# EAGLE design ds1307 (EAGLE 8.3.0)
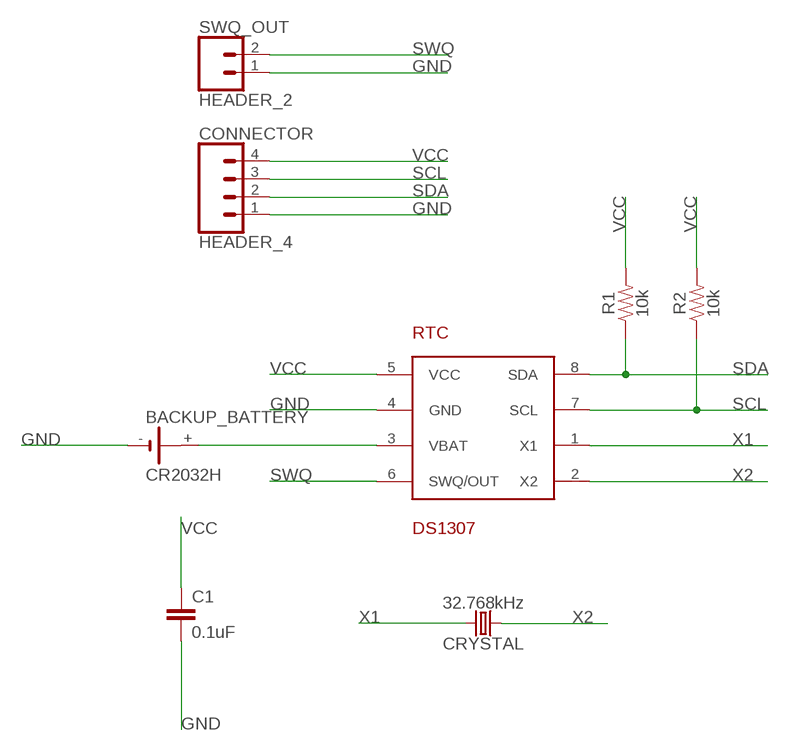
[diagram p0: schematic, sheet 1]

## Parts
BACKUP_BATTERY  CR2032H  [CR2032H]
C1  0.1uF  0.1UF-KIT-EZ-50V-20%  [CAP-PTH-SMALL-KIT]
CONNECTOR  HEADER_4  CONN_04POLAR  [MOLEX-1X4]
CRYSTAL  32.768kHz  CRYSTAL-32.768KHZPTH-2X6  [CRYSTAL-PTH-2X6-CYL]
R1  10k  10KOHM-HORIZ-1/4W-1%  [AXIAL-0.3]
R2  10k  10KOHM-HORIZ-1/4W-1%  [AXIAL-0.3]
RTC  DS1307  [MAXIM_DIP8]
SWQ_OUT  HEADER_2  CONN_02  [1X02]

## Nets
GND: BACKUP_BATTERY.- C1.2 CONNECTOR.1 RTC.4(GND) SWQ_OUT.1
N$1: BACKUP_BATTERY.+ RTC.3(VBAT)
SCL: CONNECTOR.3 R2.P$1 RTC.7(SCL)
SDA: CONNECTOR.2 R1.P$1 RTC.8(SDA)
SWQ: RTC.6(SWQ/OUT) SWQ_OUT.2
VCC: C1.1 CONNECTOR.4 R1.P$2 R2.P$2 RTC.5(VCC)
X1: CRYSTAL.2 RTC.1(X1)
X2: CRYSTAL.1 RTC.2(X2)
Unconnected: BACKUP_BATTERY.+@1(+)

## Library data of the parts
BACKUP_BATTERY = battery:CR2032H: LI BATTERY Varta
C1 = SparkFun-Capacitors:0.1UF: 0.1µF ceramic capacitors A capacitor is a passive two-terminal electrical component used to store electrical energy temporarily in an electric field.; PROD_ID: CAP-08370
CONNECTOR = SparkFun-Connectors:CONN_04: Multi connection point. Often used as Generic Header-pin footprint for 0.1 inch spaced/style header connections On any of the 0.1 inch spaced packages, you can populate with these: Break Away Headers - Straight <https://www.sparkfun.com/products/116> (PRT-00116) Break Away Male Headers - Right Angle <https://www.sparkfun.com/products/553> (PRT-00553) Female Headers <https://www.sparkfun.com/products/115> (PRT-00115) Break Away Headers - Machine Pin <https://www.sparkfun.com/products/117> (PRT-00117) Break Away Female Headers - Swiss Machine Pin <https://www.sparkfun.com/products/743> (PRT-00743) For SCREWTERMINALS and SPRING TERMINALS visit here: Screw Terimnals on SparkFun.com <https://www.sparkfun.com/search/results?term=Screw+Terminals> (5mm/3.5mm/2.54mm spacing) This device is also useful as a general connection point to wire up your design to another part of your project. Our various solder wires solder well into these plated through hole pads. Hook-Up Wire - Assortment (Stranded, 22 AWG) <https://www.sparkfun.com/products/11375> (PRT-11375) Hook-Up Wire - Assortment (Solid Core, 22 AWG) <https://www.sparkfun.com/products/11367> (PRT-11367) View the entire wire category on our website here <https://www.sparkfun.com/categories/141> Special notes: Molex polarized connector foot print use with SKU : PRT-08231 with associated crimp pins and housings. 1MM SMD Version SKU: PRT-10208; PROD_ID: CONN-08186; SF_ID: PRT-08231
CRYSTAL = SparkFun-Clocks:CRYSTAL-32.768KHZ: 32.768kHz Crystal Frequency: 32.768kHz Frequency Stability: ±20ppm Load Capacitance: 12.5pF (PTH-2X6 & SMD-3.2X1.5), 6pF (SMD-2X6) SparkFun Products: SparkFun BigTime Watch Kit <https://www.sparkfun.com/products/11734> SparkFun nRF52832 Breakout <https://www.sparkfun.com/products/13990> SparkFun Real Time Clock Module <https://www.sparkfun.com/products/12708>; PROD_ID: XTAL-10112
R1 R2 = SparkFun-Resistors:10KOHM: 10kΩ resistor A resistor is a passive two-terminal electrical component that implements electrical resistance as a circuit element. Resistors act to reduce current flow, and, at the same time, act to lower voltage levels within circuits. - Wikipedia; PROD_ID: RES-12183
RTC = parts:DS1307
SWQ_OUT = SparkFun-Connectors:CONN_02: Multi connection point. Often used as Generic Header-pin footprint for 0.1 inch spaced/style header connections On any of the 0.1 inch spaced packages, you can populate with these: Break Away Headers - Straight <https://www.sparkfun.com/products/116> (PRT-00116) Break Away Male Headers - Right Angle <https://www.sparkfun.com/products/553> (PRT-00553) Female Headers <https://www.sparkfun.com/products/115> (PRT-00115) Break Away Headers - Machine Pin <https://www.sparkfun.com/products/117> (PRT-00117) Break Away Female Headers - Swiss Machine Pin <https://www.sparkfun.com/products/743> (PRT-00743) For SCREWTERMINALS and SPRING TERMINALS visit here: Screw Terimnals on SparkFun.com <https://www.sparkfun.com/search/results?term=Screw+Terminals> (5mm/3.5mm/2.54mm spacing) This device is also useful as a general connection point to wire up your design to another part of your project. Our various solder wires solder well into these plated through hole pads. Hook-Up Wire - Assortment (Stranded, 22 AWG) <https://www.sparkfun.com/products/11375> (PRT-11375) Hook-Up Wire - Assortment (Solid Core, 22 AWG) <https://www.sparkfun.com/products/11367> (PRT-11367) View the entire wire category on our website here <https://www.sparkfun.com/categories/141> Special notes: Molex polarized connector foot print use with: PRT-08233 with associated crimp pins and housings. 2.54_SCREWTERM for use with PRT-10571. 3.5mm Screw Terminal footprints for PRT-08084 5mm Screw Terminal footprints for use with PRT-08432

## Board
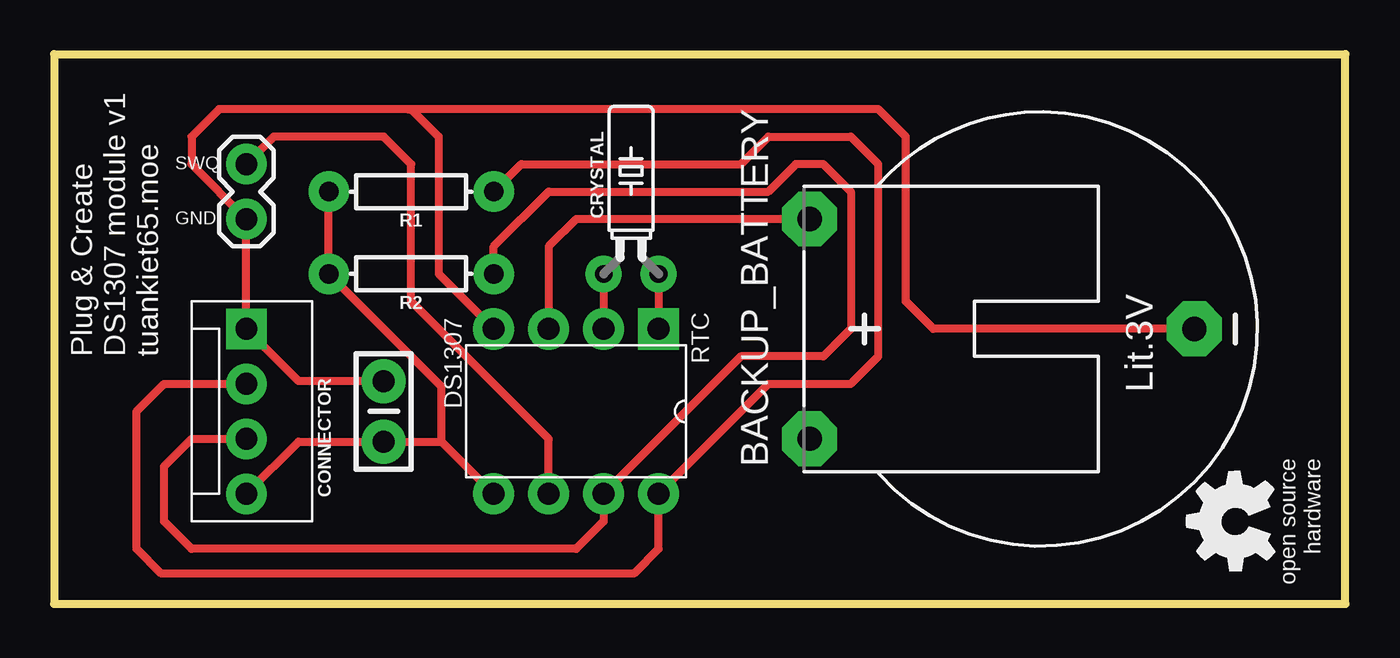
[diagram p1: board, top side]

Size 59.69 x 25.4 mm. Coordinates in mm from the lower left corner, seen from the top.
Outline: 59.69,24.13 59.69,0
Outline: 59.69,0 0,0 0,25.4 59.69,25.4 59.69,0
Copper layers (1*16): Top 0.0356mm / dielectric 1.5011mm / Bottom 0.0356mm
Design rules "oshpark-2layer": minimum track width 6mil, minimum drill 13mil, track to track 6mil, track to pad 6mil, pad to pad 6mil, via to via 6mil, smd to smd 6mil, copper to edge 15mil, drill to drill 6mil, minimum pad ring 7mil, minimum via ring 7mil, stop-mask expansion 2.5mil, vias tented up to drill 0mil, thermal gap 10mil

### Footprints (pad centres in the part's own frame; a part is rotated, then mirrored left to right if it is on the bottom)
CR2032H = drill 1.118 pad 2.54 octagon: + 5.08,10.795; +@1 -5.08,10.795; - 0,-6.985
CAP-PTH-SMALL-KIT = drill 1.016 pad 2.032: 1 -1.397,0; 2 1.397,0
MOLEX-1X4 = drill 1.016 pad 1.88 square: 1 0,0 | drill 1.016 pad 1.88: 2 2.54,0; 3 5.08,0; 4 7.62,0
CRYSTAL-PTH-2X6-CYL = drill 0.813 pad 1.676: 1 -1.27,0; 2 1.27,0
AXIAL-0.3 = drill 0.9 pad 1.88: P$1 -3.81,0; P$2 3.81,0
MAXIM_DIP8 = drill 1.016 pad 1.905 square: 1 0,7.62 | drill 1.016 pad 1.905: 2 0,5.08; 3 0,2.54; 4 0,0; 5 7.62,0; 6 7.62,2.54; 7 7.62,5.08; 8 7.62,7.62
1X02 = drill 1.016 pad 1.88: 1 0,0; 2 2.54,0

### Placement (x,y rotation side)
BACKUP_BATTERY  45.72,12.7 90 top
C1  15.24,8.89 90 top
CONNECTOR  8.89,12.7 270 top
CRYSTAL  26.67,15.24 0 top
R1  16.51,19.05 180 top
R2  16.51,15.24 180 top
RTC  20.32,12.7 270 top
SWQ_OUT  8.89,17.78 90 top
U$1  [OSHW_5MM]  54.61,3.81 90 top

### Tracks (layer width: path | path; a pad name or v marks a point on that pad's centre or on a via)
GND
  Top 0.381: BACKUP_BATTERY.- 40.64,12.7 39.37,13.97 39.37,21.59 38.1,22.86 16.32,22.86 | C1.2 11.3,10.29 CONNECTOR.1 SWQ_OUT.1 6.35,20.32 6.35,21.59 7.62,22.86 16.32,22.86 | 16.32,22.86 16.51,22.86 17.78,21.59 17.78,15.24 RTC.4
N$1
  Top 0.381: BACKUP_BATTERY.+ 24.13,17.78 22.86,16.51 RTC.3
SCL
  Top 0.381: CONNECTOR.3 6.35,7.62 5.08,6.35 5.08,3.81 6.35,2.54 24.13,2.54 25.4,3.81 RTC.7 31.75,11.43 35.56,11.43 36.83,12.7 36.83,19.05 35.56,20.32 34.29,20.32 33.02,19.05 22.86,19.05 20.32,16.51 R2.P$1
SDA
  Top 0.381: CONNECTOR.2 5.08,10.16 3.81,8.89 3.81,2.54 4.95,1.4 26.8,1.4 27.94,2.54 RTC.8 33.02,10.16 36.83,10.16 38.1,11.43 38.1,20.32 36.83,21.59 33.02,21.59 31.75,20.32 21.59,20.32 R1.P$1
SWQ
  Top 0.381: 10.03,21.46 SWQ_OUT.2 | 10.03,21.46 10.16,21.59 | RTC.6 22.86,7.62 16.51,13.97 16.51,20.32 15.24,21.59 10.16,21.59 | 10.16,21.59 10.03,21.46
VCC
  Top 0.381: R1.P$2 R2.P$2 17.91,10.03 17.91,7.49 | CONNECTOR.4 11.3,7.49 C1.1 17.91,7.49 | 17.91,7.49 RTC.5
X1
  Top 0.381: CRYSTAL.2 RTC.1
X2
  Top 0.381: CRYSTAL.1 RTC.2

### Text on the board
tPlace: SWQ | GND | Plug & Create / DS1307 module v1 / tuankiet65.moe